# EAGLE design untitled (EAGLE 9.6.2)
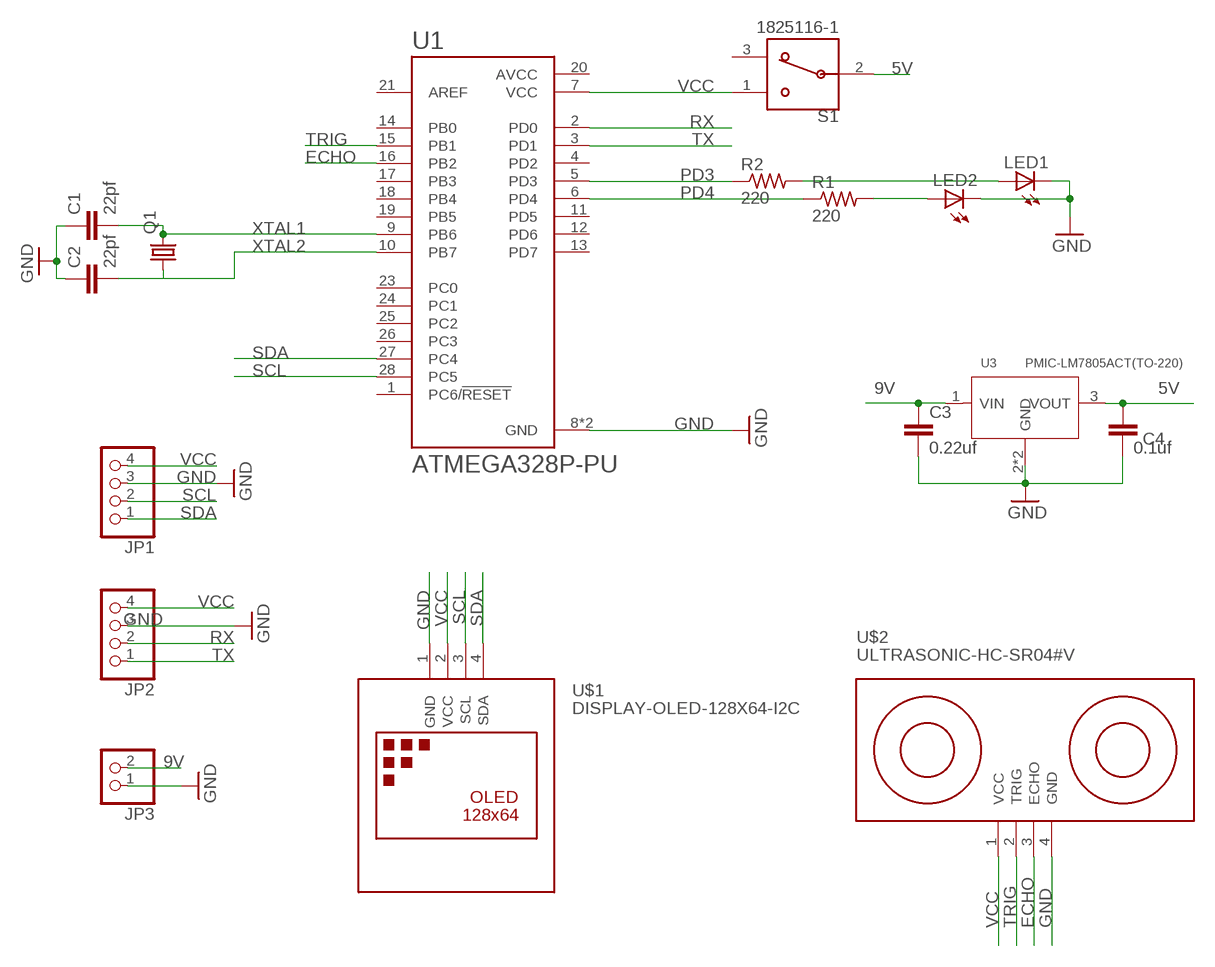
[diagram p0: schematic, sheet 1]

## Parts
C1  22pf  C2.5/2  [C2.5-2]
C2  22pf  C2.5/2  [C2.5-2]
C3  0.22uf  C2.5/2  [C2.5-2]
C4  0.1uf  C2.5/2  [C2.5-2]
JP1  HEADER-1X4  [1X04_OVAL]
JP2  HEADER-1X4  [1X04_OVAL]
JP3  HEADER-1X2  [1X02_OVAL]
LED1  LED3MM  [LED3MM]
LED2  LED3MM  [LED3MM]
Q1  CRYSTALHC49S  [HC49/S]
R1  220  R-US_0204/5  [0204/5]
R2  220  R-US_0204/5  [0204/5]
S1  1825116-1  [SW_1825116-1]
U1  ATMEGA328P-PU  [DIP794W46P254L2967H457Q28B]
U3  PMIC-LM7805ACT(TO-220)  [TO-220]
U$1  DISPLAY-OLED-128X64-I2C  [DISPLAY-OLED-128X64-I2C]
U$2  ULTRASONIC-HC-SR04#V  [ULTRASONIC-HC-SR04#V]

## Nets
5V: C4.1 S1.2 U3.3(VOUT)
9V: C3.1 JP3.2 U3.1(VIN)
ECHO: U1.16(PB2) U$2.3(ECHO)
GND: C1.1 C2.1 C3.2 C4.2 JP1.3 JP2.3 JP3.1 LED1.K(C) LED2.K(C) U1.8(GND) U1.22(GND) U3.2(GND) U3.HEAT(GND) U$1.1(GND) U$2.4(GND)
N$1: LED1.A R2.2
N$2: LED2.A R1.2
PD3: R2.1 U1.5(PD3)
PD4: R1.1 U1.6(PD4)
RX: JP2.2 U1.2(PD0)
SCL: JP1.2 U1.28(PC5) U$1.3(SCL)
SDA: JP1.1 U1.27(PC4) U$1.4(SDA)
TRIG: U1.15(PB1) U$2.2(TRIG)
TX: JP2.1 U1.3(PD1)
VCC: JP1.4 JP2.4 S1.1 U1.7(VCC) U$1.2(VCC) U$2.1(VCC)
XTAL1: C1.2 Q1.2 U1.9(PB6)
XTAL2: C2.2 Q1.1 U1.10(PB7)
Unconnected: S1.3 U1.1(PC6/!RESET) U1.4(PD2) U1.11(PD5) U1.12(PD6) U1.13(PD7) U1.14(PB0) U1.17(PB3) U1.18(PB4) U1.19(PB5) U1.21(AREF) U1.23(PC0) U1.24(PC1) U1.25(PC2) U1.26(PC3)

## Power pins joined to a net without a drawn wire
AVCC: U1.20(AVCC)

## Library data of the parts
C1-C4 = capacitor-wima:C: CAPACITOR naming: grid - package width
JP1 JP2 = microbuilder:HEADER-1X4: PIN HEADER
JP3 = microbuilder:HEADER-1X2: PIN HEADER
LED1 LED2 = adafruit:LED: LED OSRAM: - CHIPLED LG R971, LG N971, LY N971, LG Q971, LY Q971, LO R971, LY R971 LH N974, LH R974 LS Q976, LO Q976, LY Q976 LO Q996 - Hyper CHIPLED LW Q18S LB Q993, LB Q99A, LB R99A - SideLED LS A670, LO A670, LY A670, LG A670, LP A670 LB A673, LV A673, LT A673, LW A673 LH A674 LY A675 LS A676, LA A676, LO A676, LY A676, LW A676 LS A679, LY A679, LG A679 - Hyper Micro SIDELED® LS Y876, LA Y876, LO Y876, LY Y876 LT Y87S - SmartLED LW L88C, LW L88S LB L89C, LB L89S, LG L890 LS L89K, LO L89K, LY L89K LS L896, LA L896, LO L896, LY L896 - TOPLED LS T670, LO T670, LY T670, LG T670, LP T670 LSG T670, LSP T670, LSY T670, LOP T670, LYG T670 LG T671, LOG T671, LSG T671 LB T673, LV T673, LT T673, LW T673 LH T674 LS T676, LA T676, LO T676, LY T676, LB T676, LH T676, LSB T676, LW T676 LB T67C, LV T67C, LT T67C, LS T67K, LO T67K, LY T67K, LW E67C LS E67B, LA E67B, LO E67B, LY E67B, LB E67C, LV E67C, LT E67C LW T67C LS T679, LY T679, LG T679 LS T770, LO T770, LY T770, LG T770, LP T770 LB T773, LV T773, LT T773, LW T773 LH T774 LS E675, LA E675, LY E675, LS T675 LS T776, LA T776, LO T776, LY T776, LB T776 LHGB T686 LT T68C, LB T68C - Hyper Mini TOPLED® LB M676 - Mini TOPLED Santana® LG M470 LS M47K, LO M47K, LY M47K Source: http://www.osram.convergy.de/
Q1 = adafruit:CRYSTAL: CRYSTAL; OC_FARNELL: 1667008; OC_NEWARK: unknown
R1 R2 = adafruit:R-US_: RESISTOR, American symbol
S1 = 1825116-1:1825116-1: SLS-PC Series 2 Position SPDT Top Actuator Through Hole Right Angle Slide Switch Check prices <https://pricing.snapeda.com/parts/1825116-1/TE%20Connectivity/view-part?ref=eda>; AVAILABILITY: Warning; COMMENT: 1825116-1; DESCRIPTION: Slide Switch SPDT Through Hole, Right Angle; EU_ROHS_COMPLIANCE: Compliant; MF: TE Connectivity; MP: 1825116-1; PACKAGE: None; PRICE: None
U1 = ATMEGA328P-PU:ATMEGA328P-PU: ATmega Series 20 MHz 32 KB Flash 2 KB SRAM 8-Bit Microcontroller - DIP-28 Check prices <https://pricing.snapeda.com/parts/ATMEGA328P-PU/Microchip%20Technology/view-part?ref=eda>; AVAILABILITY: Good; DESCRIPTION: MCU 8-bit AVR RISC 32KB Flash 2.5V/3.3V/5V 28-Pin PDIP W Tube; MF: Microchip Technology; MP: ATMEGA328P-PU; PACKAGE: DIP-28 Microchip Technology; PRICE: None; PURCHASE-URL: https://pricing.snapeda.com/search/part/ATMEGA328P-PU/?ref=eda
U3 = PMIC-LM7805ACT_TO-220_:PMIC-LM7805ACT(TO-220): 310030049 Check prices <https://pricing.snapeda.com/parts/LM7805ACT/ON%20Semiconductor/view-part?ref=eda>; AVAILABILITY: Bad; DESCRIPTION: Linear Voltage Regulator IC Positive Fixed 1 Output 1A TO-220-3; MF: ON Semiconductor; MP: LM7805ACT; PACKAGE: TO-220-3 ON Semiconductor; PRICE: None
U$1 = diy-modules:DISPLAY-OLED-128X64-I2C: 128x64 Dot Matrix OLED Module based on SSD1306 chip Variant with I2C interface More details available here: http://www.instructables.com/id/Monochrome-096-i2c-OLED-display-with-arduino-SSD13/ SSD1306 datasheet: https://cdn-shop.adafruit.com/datasheets/SSD1306.pdf Click here to find device on ebay.com <http://www.ebay.com/sch/oled+display+128x64+iic> Note: There are two variants: I2C and SPI. Search for the proper version.
U$2 = diy-modules:ULTRASONIC-HC-SR04: Ultrasonic Ranging Module HC-SR04 More details available here: http://randomnerdtutorials.com/complete-guide-for-ultrasonic-sensor-hc-sr04/ Click here to find device on ebay.com <http://www.ebay.com/sch/hc+sr04+ultrasonic>

## Board
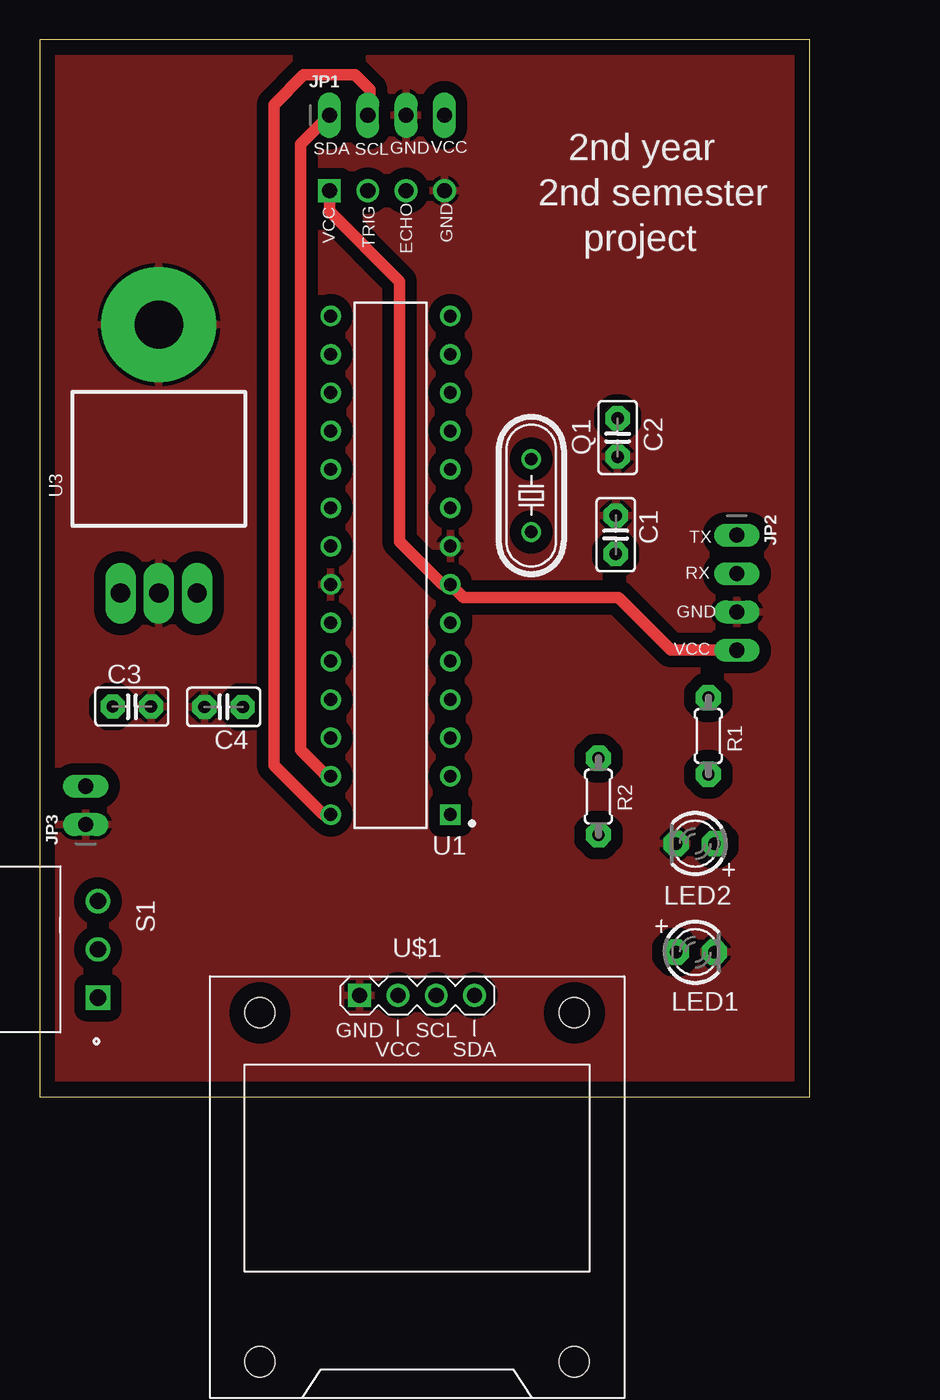
[diagram p1: board, top side]
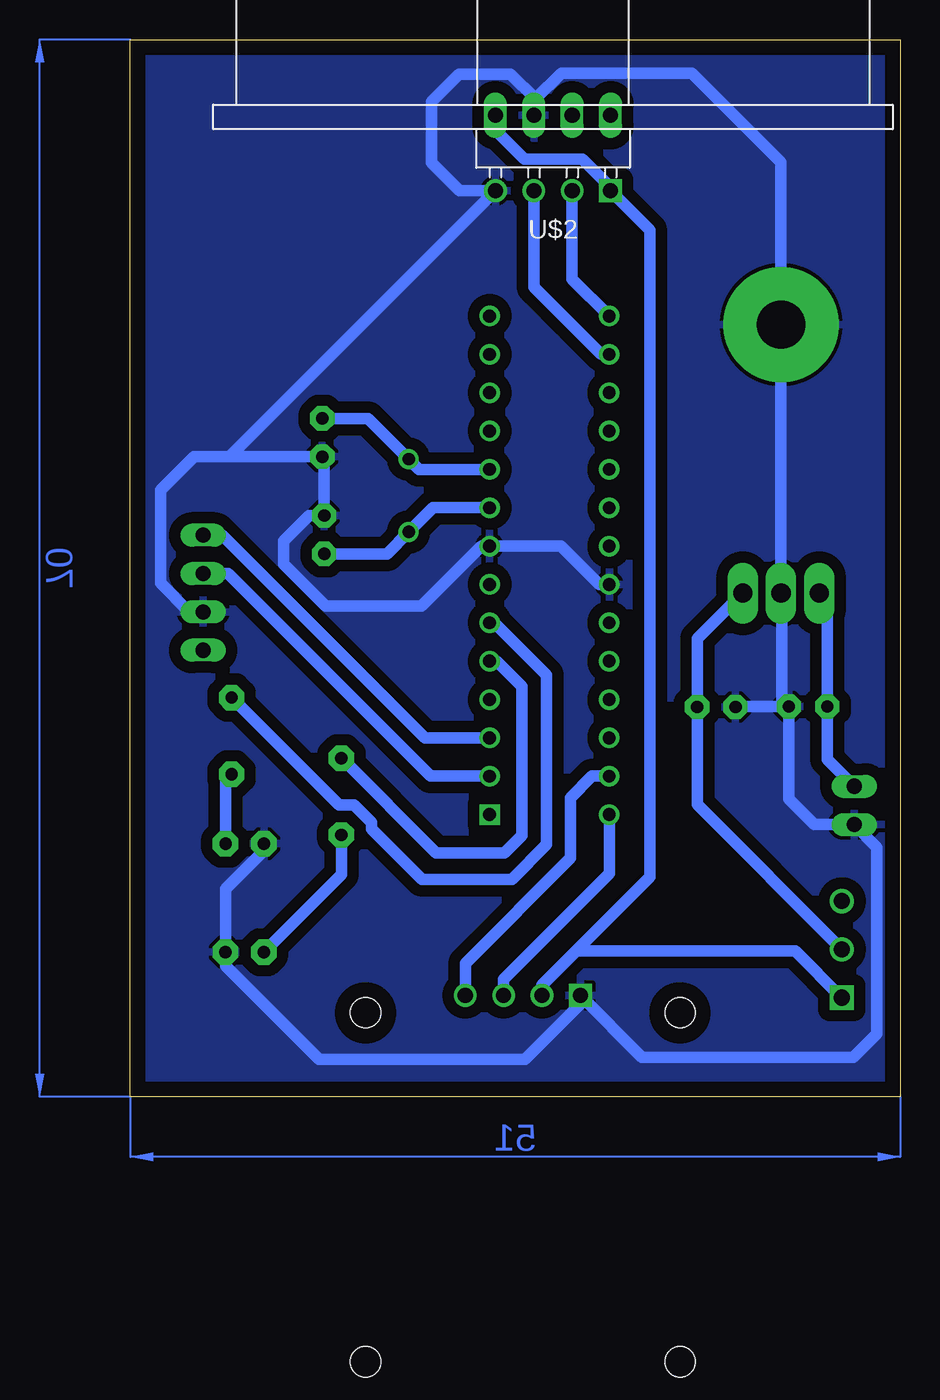
[diagram p2: board, bottom side, seen from below]

Size 51 x 70 mm. Coordinates in mm from the lower left corner, seen from the top.
Outline: 0,0 51,0 51,70 0,70 0,0
Copper layers (1*16): Top 0.035mm / dielectric 1.5mm / Bottom 0.035mm
Design rules "default *": minimum track width 30mil, minimum drill 0.35mm, track to track 30mil, track to pad 30mil, pad to pad 30mil, via to via 6mil, smd to smd 6mil, copper to edge 40mil, drill to drill 6mil, minimum pad ring 10mil, minimum via ring 8mil, stop-mask expansion 4mil, vias tented up to drill 0mil, thermal gap 10mil

### Footprints (pad centres in the part's own frame; a part is rotated, then mirrored left to right if it is on the bottom)
C2.5-2 = drill 0.813 pad 1.6 octagon: 1 -1.27,0; 2 1.27,0
1X04_OVAL = drill 1 long: 1 -3.81,0; 2 -1.27,0; 3 1.27,0; 4 3.81,0
1X02_OVAL = drill 1 long: 1 -1.27,0; 2 1.27,0
LED3MM = drill 0.813 pad 1.676 octagon: A -1.27,0; K 1.27,0
HC49/S = drill 0.813: 1 -2.413,0; 2 2.413,0
0204/5 = drill 0.813 pad 1.676 octagon: 1 -2.54,0; 2 2.54,0
SW_1825116-1 = drill 1.07 square: 1 0,0 | drill 1.07: 2 3.2,0; 3 6.4,0
DIP794W46P254L2967H457Q28B = drill 0.85 square: 1 -3.96,16.51 | drill 0.85: 2 -3.96,13.97; 3 -3.96,11.43; 4 -3.96,8.89; 5 -3.96,6.35; 6 -3.96,3.81; 7 -3.96,1.27; 8 -3.96,-1.27; 9 -3.96,-3.81; 10 -3.96,-6.35; 11 -3.96,-8.89; 12 -3.96,-11.43; 13 -3.96,-13.97; 14 -3.96,-16.51; 15 3.96,-16.51; 16 3.96,-13.97; 17 3.96,-11.43; 18 3.96,-8.89; 19 3.96,-6.35; 20 3.96,-3.81; 21 3.96,-1.27; 22 3.96,1.27; 23 3.96,3.81; 24 3.96,6.35; 25 3.96,8.89; 26 3.96,11.43; 27 3.96,13.97; 28 3.96,16.51
TO-220 = drill 1.27 pad 2.032 long: 1 -2.54,-11.43; 2 0,-11.43; 3 2.54,-11.43 | drill 3.2 pad 7.62: HEAT 0,6.35
DISPLAY-OLED-128X64-I2C = drill 1 square: 1 -3.81,12.7 | drill 1: 2 -1.27,12.7; 3 1.27,12.7; 4 3.81,12.7 | hole 2: -10.414,11.557; 10.414,11.557; 10.414,-11.557; -10.414,-11.557
ULTRASONIC-HC-SR04#V = drill 1 square: 1 -3.81,0 | drill 1: 2 -1.27,0; 3 1.27,0; 4 3.81,0

### Placement (x,y rotation side)
C1  38.15,37.22 270 top
C2  38.28,43.65 90 top
C3  6.1,25.84 0 top
C4  12.18,25.81 180 top
JP1  23,65 0 top
JP2  46.17,33.37 270 top
JP3  3.05,19.29 90 top
LED1  43.42,9.57 0 top
LED2  43.42,16.75 180 top
Q1  32.56,39.81 270 top
R1  44.29,23.89 270 top
R2  37.01,19.88 270 top
S1  3.86,6.55 90 top
U1  23.24,35.19 180 top
U3  7.89,44.78 0 top
U$1  25,-6 0 top
U$2  23,60 180 bottom

### Tracks (layer width: path | path; a pad name or v marks a point on that pad's centre or on a via)
5V
  Bottom 0.762: U3.3 13.45,30.33 C4.1 13.45,19.34 S1.2
9V
  Bottom 0.762: U3.1 4.83,32.83 C3.1 4.83,22.34 JP3.2
ECHO
  Bottom 0.762: U$2.3 24.27,53.62 19.81,49.16 U1.16
GND
  Bottom 0.762: U3.2 7.83,33.29 7.83,26.29 C3.2 | C3.2 10.88,25.84 C4.2 | C3.2 7.37,19.72 5.67,18.02 JP3.1 1.55,16.52 1.55,4.17 3.1,2.62 17.11,2.62 U$1.1 21.19,6.14 24.87,2.46 38.51,2.46 44.69,8.65 LED1.K 44.69,13.76 42.15,16.3 LED2.K | U3.2 U3.HEAT 7.89,61.89 13.79,67.79 22.45,67.79 24.17,66.08 | 44.43,42.38 46.77,42.38 49,40.16 49,34 47.1,32.1 JP2.3 | 44.43,42.38 C2.1 38.16,42.26 C1.1 39.16,38.49 40.85,36.79 40.85,35.28 38.06,32.49 31.71,32.49 27.73,36.46 U1.8 22.48,36.46 19.94,33.92 U1.22 | JP1.3 24.27,65.7 24.41,65.84 24.17,66.08 | 24.17,66.08 25.81,67.72 29.21,67.72 31.04,65.89 31.04,61.85 29.19,60 U$2.4 44.43,42.38 | U3.2 7.89,35.83
  pour Bottom: 0.05,69.94 0.05,0.05 51,0.05 51,69.96 0.13,69.96
  pour Top: 0.13,0.08 51.07,0.08 51.07,69.81 0.08,69.81 0.08,0.1
N$1
  Bottom 0.762: R2.2 37.01,14.71 LED1.A
N$2
  Bottom 0.762: R1.2 44.69,20.95 LED2.A
PD3
  Bottom 0.762: U1.5 26.76,28.84 25.07,27.15 25.07,17.3 26.21,16.15 30.75,16.15 R2.1
PD4
  Bottom 0.762: U1.6 26.86,31.38 23.42,27.94 23.42,16.69 25.73,14.38 31.67,14.38 35.03,17.73 35.03,18.16 36.19,19.32 37.18,19.32 R1.1
RX
  Bottom 0.762: U1.2 31.11,21.22 44.53,34.64 JP2.2
SCL
  Top 0.762: U1.28 18.77,18.68 15.52,21.93 15.52,65.71 17.48,67.67 20.9,67.67 21.87,66.7 21.87,65.14 JP1.2
  Bottom 0.762: U1.28 19.28,14.77 26.27,7.78 U$1.3
SDA
  Top 0.762: U1.27 19,21.22 17.27,22.95 17.27,63.08 JP1.1
  Bottom 0.762: U1.27 20.41,21.22 21.84,19.79 21.84,15.8 28.81,8.83 U$1.4
TRIG
  Bottom 0.762: U$2.2 21.73,54.15 U1.15
TX
  Bottom 0.762: U1.3 31.49,23.76 44.91,37.18 JP2.1
VCC
  Top 0.762: U$2.1 19.19,58.63 23.85,53.97 23.85,36.76 26.69,33.92 U1.7 28.07,33.04 38.34,33.04 41.82,29.56 JP2.4
  Bottom 0.762: JP1.4 26.81,64.02 24.89,62.1 21.06,62.1 19.19,60.23 U$2.1 16.59,57.4 16.59,14.55 23.73,7.41 U$1.2 23.73,7.36 21.44,9.65 6.96,9.65 S1.1
XTAL1
  Bottom 0.762: U1.9 30.96,39 Q1.2 34.01,35.95 C1.2
XTAL2
  Bottom 0.762: U1.10 31.87,41.54 Q1.1 35.25,44.92 C2.2
(copper drawn outside any net)
  shapes: Bottom area x2

### Text on the board
tPlace: SDA | SCL | GND | VCC | 2nd year | 2nd semester | VCC | GND | TRIG | ECHO | project | TX | RX | GND | VCC